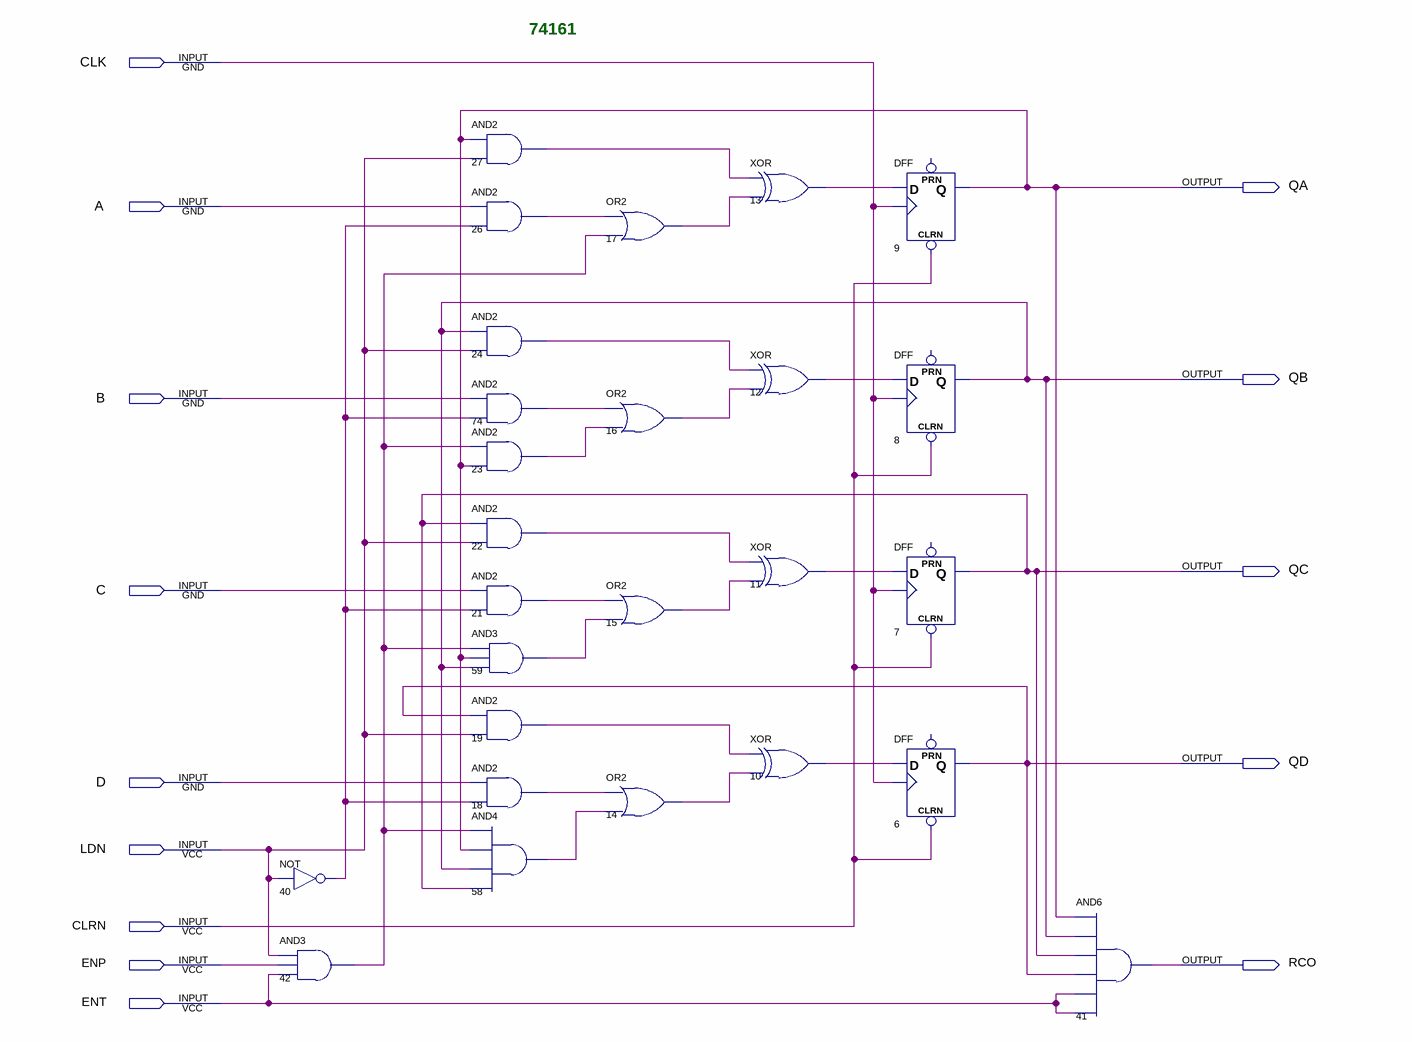
[diagram p0: schematic sheet]
// Quartus schematic p74161.bdf as structural Verilog: 26 symbols, 14 pins
module p74161 (
  input  CLK,
  input  A,
  input  B,
  input  C,
  input  D,
  input  LDN,
  input  CLRN,
  input  ENP,
  input  ENT,
  output QA,
  output QB,
  output QC,
  output QD,
  output RCO
);

  wire n10_out, n11_out, n12_out, n13_out, n14_out, n15_out, n16_out, n17_out, n18_out, n19_out, n21_out,
       n22_out, n23_out, n24_out, n26_out, n27_out, n40_out, n42_out, n58_out, n59_out, n74_out;

  not u_40 (n40_out, LDN);
  and u_42 (n42_out, LDN, ENP, ENT);
  and u_27 (n27_out, QA, LDN);
  and u_26 (n26_out, A, n40_out);
  and u_24 (n24_out, QB, LDN);
  and u_74 (n74_out, B, n40_out);
  and u_23 (n23_out, n42_out, QA);
  and u_22 (n22_out, QC, LDN);
  and u_21 (n21_out, C, n40_out);
  and u_59 (n59_out, n42_out, QA, QB);
  and u_19 (n19_out, QD, LDN);
  and u_18 (n18_out, D, n40_out);
  and u_58 (n58_out, n42_out, QA, QB, QC);
  or u_17 (n17_out, n26_out, n42_out);
  or u_16 (n16_out, n74_out, n23_out);
  or u_15 (n15_out, n21_out, n59_out);
  or u_14 (n14_out, n18_out, n58_out);
  xor u_13 (n13_out, n27_out, n17_out);
  xor u_12 (n12_out, n24_out, n16_out);
  xor u_11 (n11_out, n22_out, n15_out);
  xor u_10 (n10_out, n19_out, n14_out);
  DFF u_9 (.CLRN(CLRN), .CLK(CLK), .D(n13_out), .Q(QA));  // open: PRN
  DFF u_8 (.CLRN(CLRN), .CLK(CLK), .D(n12_out), .Q(QB));  // open: PRN
  DFF u_7 (.CLRN(CLRN), .CLK(CLK), .D(n11_out), .Q(QC));  // open: PRN
  DFF u_6 (.CLRN(CLRN), .CLK(CLK), .D(n10_out), .Q(QD));  // open: PRN
  and u_41 (RCO, QA, QB, QC, QD, ENT, ENT);

  // Notes on the sheet:
  //   74161
endmodule
